# Vivado block design bd_8be5, xcvp1802-lsvc4072-2MP-e-S, Vivado 2022.2.2
# (continued, part 2 of 3)
set_property -dict [list \
  CONFIG.CONTROLLERTYPE LPDDR4_SDRAM \
  CONFIG.MC_ATTR_FILE nocattrs.dat \
  CONFIG.MC_CASLATENCY 28 \
  CONFIG.MC_CASWRITELATENCY 14 \
  CONFIG.MC_CHAN_REGION0 DDR_LOW0 \
  CONFIG.MC_CHAN_REGION1 DDR_LOW1 \
  CONFIG.MC_COMPONENT_WIDTH x32 \
  CONFIG.MC_DATAWIDTH 32 \
  CONFIG.MC_DC_CMD_CREDITS 0x000002a8 \
  CONFIG.MC_DM_WIDTH 4 \
  CONFIG.MC_DQS_WIDTH 4 \
  CONFIG.MC_DQ_WIDTH 32 \
  CONFIG.MC_EN_INTR_RESP TRUE \
  CONFIG.MC_EXMON_CLR_EXE 0x00000100 \
  CONFIG.MC_FLIPPED_PINOUT true \
  CONFIG.MC_FREQ_SEL MEMORY_CLK_FROM_SYS_CLK \
  CONFIG.MC_INTERLEAVE_SIZE 128 \
  CONFIG.MC_IP_TIMEPERIOD0_FOR_OP 5000 \
  CONFIG.MC_MEMORY_SPEEDGRADE LPDDR4-4267 \
  CONFIG.MC_MEM_INIT_FILE no_file_loaded \
  CONFIG.MC_NO_CHANNELS Dual \
  CONFIG.MC_ODTLon 6 \
  CONFIG.MC_OP_TIMEPERIOD0 625 \
  CONFIG.MC_OP_TIMEPERIOD1 513 \
  CONFIG.MC_PHYS_NAME DDRMC_X0Y0 \
  CONFIG.MC_REG_ADEC0 0x00000000 \
  CONFIG.MC_REG_ADEC1 0x00000000 \
  CONFIG.MC_REG_ADEC2 0x00100080 \
  CONFIG.MC_REG_ADEC3 0x00000078 \
  CONFIG.MC_REG_ADEC4 0x30c30c30 \
  CONFIG.MC_REG_ADEC5 0x1349140f \
  CONFIG.MC_REG_ADEC6 0x185d6554 \
  CONFIG.MC_REG_ADEC7 0x1d71b699 \
  CONFIG.MC_REG_ADEC8 0x02c30c1e \
  CONFIG.MC_REG_ADEC9 0x07185103 \
  CONFIG.MC_REG_ADEC10 0x0c2ca248 \
  CONFIG.MC_REG_ADEC11 0x007f038d \
  CONFIG.MC_REG_CMDQ_BER_RATE_CTRL 0x003ffc0f \
  CONFIG.MC_REG_CMDQ_BEW_RATE_CTRL 0x003ffc0f \
  CONFIG.MC_REG_CMDQ_CTRL0 0x01084210 \
  CONFIG.MC_REG_CMDQ_CTRL1 0x01084210 \
  CONFIG.MC_REG_CMDQ_ISR_RATE_CTRL 0x003ffc0f \
  CONFIG.MC_REG_CMDQ_ISW_RATE_CTRL 0x003ffc0f \
  CONFIG.MC_REG_CMDQ_LLR_RATE_CTRL 0x003ffc0f \
  CONFIG.MC_REG_NSU0_PORT 0x00000240 \
  CONFIG.MC_REG_NSU1_PORT 0x00000280 \
  CONFIG.MC_REG_NSU2_PORT 0x000002c0 \
  CONFIG.MC_REG_NSU3_PORT 0x00000300 \
  CONFIG.MC_REG_P0_BER_RATE_CTRL 0x003ffc0f \
  CONFIG.MC_REG_P0_BEW_RATE_CTRL 0x003ffc0f \
  CONFIG.MC_REG_P0_ISR_RATE_CTRL 0x003ffc0f \
  CONFIG.MC_REG_P0_ISW_RATE_CTRL 0x003ffc0f \
  CONFIG.MC_REG_P0_LLR_RATE_CTRL 0x003ffc0f \
  CONFIG.MC_REG_P1_BER_RATE_CTRL 0x003ffc0f \
  CONFIG.MC_REG_P1_BEW_RATE_CTRL 0x003ffc0f \
  CONFIG.MC_REG_P1_ISR_RATE_CTRL 0x003ffc0f \
  CONFIG.MC_REG_P1_ISW_RATE_CTRL 0x003ffc0f \
  CONFIG.MC_REG_P1_LLR_RATE_CTRL 0x003ffc0f \
  CONFIG.MC_REG_P2_BER_RATE_CTRL 0x003ffc0f \
  CONFIG.MC_REG_P2_BEW_RATE_CTRL 0x003ffc0f \
  CONFIG.MC_REG_P2_ISR_RATE_CTRL 0x003ffc0f \
  CONFIG.MC_REG_P2_ISW_RATE_CTRL 0x003ffc0f \
  CONFIG.MC_REG_P2_LLR_RATE_CTRL 0x003ffc0f \
  CONFIG.MC_REG_P3_BER_RATE_CTRL 0x003ffc0f \
  CONFIG.MC_REG_P3_BEW_RATE_CTRL 0x003ffc0f \
  CONFIG.MC_REG_P3_ISR_RATE_CTRL 0x003ffc0f \
  CONFIG.MC_REG_P3_ISW_RATE_CTRL 0x003ffc0f \
  CONFIG.MC_REG_P3_LLR_RATE_CTRL 0x003ffc0f \
  CONFIG.MC_REG_QOS0 0x001e01e0 \
  CONFIG.MC_REG_QOS1 0x0ff00804 \
  CONFIG.MC_REG_QOS2 0x0003fc02 \
  CONFIG.MC_REG_QOS_RATE_CTRL_SCALE 0x00000000 \
  CONFIG.MC_REG_QOS_TIMEOUT0 0x01084210 \
  CONFIG.MC_REG_QOS_TIMEOUT1 0xffffffff \
  CONFIG.MC_REG_QOS_TIMEOUT2 0x000000ff \
  CONFIG.MC_REG_RATE_CTRL_SCALE 0x00000000 \
  CONFIG.MC_REG_RD_DRR_TKN_P0 0x00ff0404 \
  CONFIG.MC_REG_RD_DRR_TKN_P1 0x00ff0404 \
  CONFIG.MC_REG_RD_DRR_TKN_P2 0x00ff0404 \
  CONFIG.MC_REG_RD_DRR_TKN_P3 0x00ff0404 \
  CONFIG.MC_REG_WR_DRR_TKN_P0 0x0000ff04 \
  CONFIG.MC_REG_WR_DRR_TKN_P1 0x0000ff04 \
  CONFIG.MC_REG_WR_DRR_TKN_P2 0x0000ff04 \
  CONFIG.MC_REG_WR_DRR_TKN_P3 0x0000ff04 \
  CONFIG.MC_STACKHEIGHT 1 \
  CONFIG.MC_SYSTEM_CLOCK Differential \
  CONFIG.MC_TCKE 12 \
  CONFIG.MC_TCKEMIN 12 \
  CONFIG.MC_TMRD_nCK 23 \
  CONFIG.MC_TMRW_nCK 16 \
  CONFIG.MC_TOSCO_nCK 64 \
  CONFIG.MC_TRAS_nCK 68 \
  CONFIG.MC_TRCD_nCK 29 \
  CONFIG.MC_TRPAB_nCK 34 \
  CONFIG.MC_TRPPB_nCK 29 \
  CONFIG.MC_TRRD_nCK 12 \
  CONFIG.MC_TWR_nCK 29 \
  CONFIG.MC_TWTR_nCK 16 \
  CONFIG.MC_TXP 12 \
  CONFIG.MC_TXPMIN 12 \
  CONFIG.MC_TZQCAL_div4 400 \
  CONFIG.MC_TZQLAT_div4 12 \
  CONFIG.MC_TZQLAT_nCK 48 \
  CONFIG.MC_UB_CLK_MUX 0x00000000 \
  CONFIG.MC_XMPU_CONFIG0 0x00000008 \
  CONFIG.MC_XMPU_CONFIG1 0x00000008 \
  CONFIG.MC_XMPU_CONFIG2 0x00000008 \
  CONFIG.MC_XMPU_CONFIG3 0x00000008 \
  CONFIG.MC_XMPU_CONFIG4 0x00000008 \
  CONFIG.MC_XMPU_CONFIG5 0x00000008 \
  CONFIG.MC_XMPU_CONFIG6 0x00000008 \
  CONFIG.MC_XMPU_CONFIG7 0x00000008 \
  CONFIG.MC_XMPU_CONFIG8 0x00000008 \
  CONFIG.MC_XMPU_CONFIG9 0x00000008 \
  CONFIG.MC_XMPU_CONFIG10 0x00000008 \
  CONFIG.MC_XMPU_CONFIG11 0x00000008 \
  CONFIG.MC_XMPU_CONFIG12 0x00000008 \
  CONFIG.MC_XMPU_CONFIG13 0x00000008 \
  CONFIG.MC_XMPU_CONFIG14 0x00000008 \
  CONFIG.MC_XMPU_CONFIG15 0x00000008 \
  CONFIG.MC_XMPU_CTRL 0x0000000b \
  CONFIG.MC_XMPU_END_HI0 0x00000000 \
  CONFIG.MC_XMPU_END_HI1 0x00000000 \
  CONFIG.MC_XMPU_END_HI2 0x00000000 \
  CONFIG.MC_XMPU_END_HI3 0x00000000 \
  CONFIG.MC_XMPU_END_HI4 0x00000000 \
  CONFIG.MC_XMPU_END_HI5 0x00000000 \
  CONFIG.MC_XMPU_END_HI6 0x00000000 \
  CONFIG.MC_XMPU_END_HI7 0x00000000 \
  CONFIG.MC_XMPU_END_HI8 0x00000000 \
  CONFIG.MC_XMPU_END_HI9 0x00000000 \
  CONFIG.MC_XMPU_END_HI10 0x00000000 \
  CONFIG.MC_XMPU_END_HI11 0x00000000 \
  CONFIG.MC_XMPU_END_HI12 0x00000000 \
  CONFIG.MC_XMPU_END_HI13 0x00000000 \
  CONFIG.MC_XMPU_END_HI14 0x00000000 \
  CONFIG.MC_XMPU_END_HI15 0x00000000 \
  CONFIG.MC_XMPU_END_LO0 0x00000000 \
  CONFIG.MC_XMPU_END_LO1 0x00000000 \
  CONFIG.MC_XMPU_END_LO2 0x00000000 \
  CONFIG.MC_XMPU_END_LO3 0x00000000 \
  CONFIG.MC_XMPU_END_LO4 0x00000000 \
  CONFIG.MC_XMPU_END_LO5 0x00000000 \
  CONFIG.MC_XMPU_END_LO6 0x00000000 \
  CONFIG.MC_XMPU_END_LO7 0x00000000 \
  CONFIG.MC_XMPU_END_LO8 0x00000000 \
  CONFIG.MC_XMPU_END_LO9 0x00000000 \
  CONFIG.MC_XMPU_END_LO10 0x00000000 \
  CONFIG.MC_XMPU_END_LO11 0x00000000 \
  CONFIG.MC_XMPU_END_LO12 0x00000000 \
  CONFIG.MC_XMPU_END_LO13 0x00000000 \
  CONFIG.MC_XMPU_END_LO14 0x00000000 \
  CONFIG.MC_XMPU_END_LO15 0x00000000 \
  CONFIG.MC_XMPU_MASTER0 0x00000000 \
  CONFIG.MC_XMPU_MASTER1 0x00000000 \
  CONFIG.MC_XMPU_MASTER2 0x00000000 \
  CONFIG.MC_XMPU_MASTER3 0x00000000 \
  CONFIG.MC_XMPU_MASTER4 0x00000000 \
  CONFIG.MC_XMPU_MASTER5 0x00000000 \
  CONFIG.MC_XMPU_MASTER6 0x00000000 \
  CONFIG.MC_XMPU_MASTER7 0x00000000 \
  CONFIG.MC_XMPU_MASTER8 0x00000000 \
  CONFIG.MC_XMPU_MASTER9 0x00000000 \
  CONFIG.MC_XMPU_MASTER10 0x00000000 \
  CONFIG.MC_XMPU_MASTER11 0x00000000 \
  CONFIG.MC_XMPU_MASTER12 0x00000000 \
  CONFIG.MC_XMPU_MASTER13 0x00000000 \
  CONFIG.MC_XMPU_MASTER14 0x00000000 \
  CONFIG.MC_XMPU_MASTER15 0x00000000 \
  CONFIG.MC_XMPU_START_HI0 0x00000000 \
  CONFIG.MC_XMPU_START_HI1 0x00000000 \
  CONFIG.MC_XMPU_START_HI2 0x00000000 \
  CONFIG.MC_XMPU_START_HI3 0x00000000 \
  CONFIG.MC_XMPU_START_HI4 0x00000000 \
  CONFIG.MC_XMPU_START_HI5 0x00000000 \
  CONFIG.MC_XMPU_START_HI6 0x00000000 \
  CONFIG.MC_XMPU_START_HI7 0x00000000 \
  CONFIG.MC_XMPU_START_HI8 0x00000000 \
  CONFIG.MC_XMPU_START_HI9 0x00000000 \
  CONFIG.MC_XMPU_START_HI10 0x00000000 \
  CONFIG.MC_XMPU_START_HI11 0x00000000 \
  CONFIG.MC_XMPU_START_HI12 0x00000000 \
  CONFIG.MC_XMPU_START_HI13 0x00000000 \
  CONFIG.MC_XMPU_START_HI14 0x00000000 \
  CONFIG.MC_XMPU_START_HI15 0x00000000 \
  CONFIG.MC_XMPU_START_LO0 0x00000000 \
  CONFIG.MC_XMPU_START_LO1 0x00000000 \
  CONFIG.MC_XMPU_START_LO2 0x00000000 \
  CONFIG.MC_XMPU_START_LO3 0x00000000 \
  CONFIG.MC_XMPU_START_LO4 0x00000000 \
  CONFIG.MC_XMPU_START_LO5 0x00000000 \
  CONFIG.MC_XMPU_START_LO6 0x00000000 \
  CONFIG.MC_XMPU_START_LO7 0x00000000 \
  CONFIG.MC_XMPU_START_LO8 0x00000000 \
  CONFIG.MC_XMPU_START_LO9 0x00000000 \
  CONFIG.MC_XMPU_START_LO10 0x00000000 \
  CONFIG.MC_XMPU_START_LO11 0x00000000 \
  CONFIG.MC_XMPU_START_LO12 0x00000000 \
  CONFIG.MC_XMPU_START_LO13 0x00000000 \
  CONFIG.MC_XMPU_START_LO14 0x00000000 \
  CONFIG.MC_XMPU_START_LO15 0x00000000 \
  CONFIG.MC_XPLL_CLKOUT1_PERIOD 1250 \
  CONFIG.NOC_FREQ 960 \
  CONFIG.NUM_MC 1 \
  CONFIG.USER_NPI_REG_MC_NSU_0_EGR 0x00473610 \
  CONFIG.USER_NPI_REG_MC_NSU_0_ING 0x04534101 \
  CONFIG.USER_NPI_REG_MC_NSU_1_EGR 0x00473610 \
  CONFIG.USER_NPI_REG_MC_NSU_1_ING 0x04534101 \
  CONFIG.USER_NPI_REG_MC_NSU_2_EGR 0x00473610 \
  CONFIG.USER_NPI_REG_MC_NSU_2_ING 0x04534101 \
  CONFIG.USER_NPI_REG_MC_NSU_3_EGR 0x00473610 \
  CONFIG.USER_NPI_REG_MC_NSU_3_ING 0x04534101 \
] [get_bd_cells MC0_ddrc]
create_bd_cell -type hier hier_nsw

# ---- hierarchy /hier_nsw ----
current_bd_instance /hier_nsw
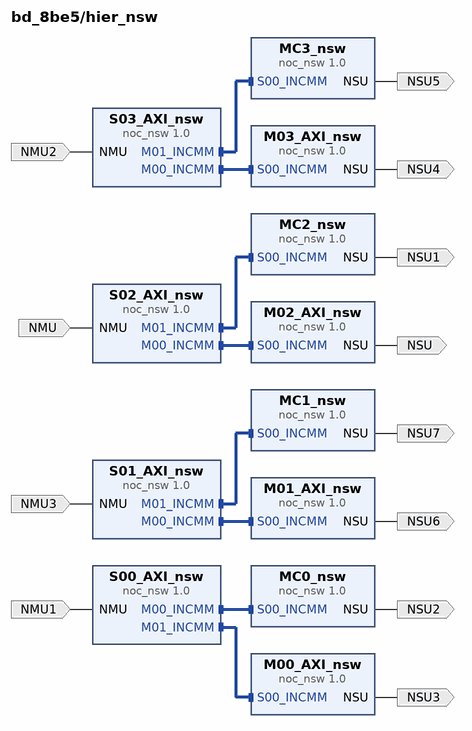
[diagram p1: block diagram inside /hier_nsw]
create_bd_pin -dir I NMU
create_bd_pin -dir O NSU
create_bd_pin -dir O NSU1
create_bd_pin -dir I NMU1
create_bd_pin -dir O NSU2
create_bd_pin -dir O NSU3
create_bd_pin -dir I NMU2
create_bd_pin -dir O NSU4
create_bd_pin -dir O NSU5
create_bd_pin -dir I NMU3
create_bd_pin -dir O NSU6
create_bd_pin -dir O NSU7

create_bd_cell -type ip -vlnv xilinx.com:ip:noc_nsw:1.0 S02_AXI_nsw
set_property -dict [list \
  CONFIG.NSW_MODE SW_Master \
  CONFIG.NSW_NUM_PATHS 2 \
  CONFIG.NSW_PATH_TYPE RDWR:RDWR \
  CONFIG.NSW_PROTOCOL MemoryMapped \
] [get_bd_cells S02_AXI_nsw]
create_bd_cell -type ip -vlnv xilinx.com:ip:noc_nsw:1.0 M02_AXI_nsw
set_property -dict [list \
  CONFIG.NSW_MODE SW_Slave \
  CONFIG.NSW_NUM_PATHS 1 \
  CONFIG.NSW_PATH_TYPE RDWR \
  CONFIG.NSW_PROTOCOL MemoryMapped \
] [get_bd_cells M02_AXI_nsw]
create_bd_cell -type ip -vlnv xilinx.com:ip:noc_nsw:1.0 MC2_nsw
set_property -dict [list \
  CONFIG.NSW_MODE SW_Slave \
  CONFIG.NSW_NUM_PATHS 1 \
  CONFIG.NSW_PATH_TYPE RDWR \
  CONFIG.NSW_PROTOCOL MemoryMapped \
] [get_bd_cells MC2_nsw]
create_bd_cell -type ip -vlnv xilinx.com:ip:noc_nsw:1.0 S00_AXI_nsw
set_property -dict [list \
  CONFIG.NSW_MODE SW_Master \
  CONFIG.NSW_NUM_PATHS 2 \
  CONFIG.NSW_PATH_TYPE RDWR:RDWR \
  CONFIG.NSW_PROTOCOL MemoryMapped \
] [get_bd_cells S00_AXI_nsw]
create_bd_cell -type ip -vlnv xilinx.com:ip:noc_nsw:1.0 MC0_nsw
set_property -dict [list \
  CONFIG.NSW_MODE SW_Slave \
  CONFIG.NSW_NUM_PATHS 1 \
  CONFIG.NSW_PATH_TYPE RDWR \
  CONFIG.NSW_PROTOCOL MemoryMapped \
] [get_bd_cells MC0_nsw]
create_bd_cell -type ip -vlnv xilinx.com:ip:noc_nsw:1.0 M00_AXI_nsw
set_property -dict [list \
  CONFIG.NSW_MODE SW_Slave \
  CONFIG.NSW_NUM_PATHS 1 \
  CONFIG.NSW_PATH_TYPE RDWR \
  CONFIG.NSW_PROTOCOL MemoryMapped \
] [get_bd_cells M00_AXI_nsw]
create_bd_cell -type ip -vlnv xilinx.com:ip:noc_nsw:1.0 S03_AXI_nsw
set_property -dict [list \
  CONFIG.NSW_MODE SW_Master \
  CONFIG.NSW_NUM_PATHS 2 \
  CONFIG.NSW_PATH_TYPE RDWR:RDWR \
  CONFIG.NSW_PROTOCOL MemoryMapped \
] [get_bd_cells S03_AXI_nsw]
create_bd_cell -type ip -vlnv xilinx.com:ip:noc_nsw:1.0 M03_AXI_nsw
set_property -dict [list \
  CONFIG.NSW_MODE SW_Slave \
  CONFIG.NSW_NUM_PATHS 1 \
  CONFIG.NSW_PATH_TYPE RDWR \
  CONFIG.NSW_PROTOCOL MemoryMapped \
] [get_bd_cells M03_AXI_nsw]
create_bd_cell -type ip -vlnv xilinx.com:ip:noc_nsw:1.0 MC3_nsw
set_property -dict [list \
  CONFIG.NSW_MODE SW_Slave \
  CONFIG.NSW_NUM_PATHS 1 \
  CONFIG.NSW_PATH_TYPE RDWR \
  CONFIG.NSW_PROTOCOL MemoryMapped \
] [get_bd_cells MC3_nsw]
create_bd_cell -type ip -vlnv xilinx.com:ip:noc_nsw:1.0 S01_AXI_nsw
set_property -dict [list \
  CONFIG.NSW_MODE SW_Master \
  CONFIG.NSW_NUM_PATHS 2 \
  CONFIG.NSW_PATH_TYPE RDWR:RDWR \
  CONFIG.NSW_PROTOCOL MemoryMapped \
] [get_bd_cells S01_AXI_nsw]
create_bd_cell -type ip -vlnv xilinx.com:ip:noc_nsw:1.0 M01_AXI_nsw
set_property -dict [list \
  CONFIG.NSW_MODE SW_Slave \
  CONFIG.NSW_NUM_PATHS 1 \
  CONFIG.NSW_PATH_TYPE RDWR \
  CONFIG.NSW_PROTOCOL MemoryMapped \
] [get_bd_cells M01_AXI_nsw]
create_bd_cell -type ip -vlnv xilinx.com:ip:noc_nsw:1.0 MC1_nsw
set_property -dict [list \
  CONFIG.NSW_MODE SW_Slave \
  CONFIG.NSW_NUM_PATHS 1 \
  CONFIG.NSW_PATH_TYPE RDWR \
  CONFIG.NSW_PROTOCOL MemoryMapped \
] [get_bd_cells MC1_nsw]

# ---- connections ----

current_bd_instance /hier_nsw
connect_bd_intf_net -intf_net S00_AXI_nsw_M00_INCMM [get_bd_intf_pins S00_AXI_nsw/M00_INCMM] [get_bd_intf_pins MC0_nsw/S00_INCMM]
connect_bd_intf_net -intf_net S00_AXI_nsw_M01_INCMM [get_bd_intf_pins S00_AXI_nsw/M01_INCMM] [get_bd_intf_pins M00_AXI_nsw/S00_INCMM]
connect_bd_intf_net -intf_net S01_AXI_nsw_M00_INCMM [get_bd_intf_pins S01_AXI_nsw/M00_INCMM] [get_bd_intf_pins M01_AXI_nsw/S00_INCMM]
connect_bd_intf_net -intf_net S01_AXI_nsw_M01_INCMM [get_bd_intf_pins S01_AXI_nsw/M01_INCMM] [get_bd_intf_pins MC1_nsw/S00_INCMM]
connect_bd_intf_net -intf_net S02_AXI_nsw_M00_INCMM [get_bd_intf_pins S02_AXI_nsw/M00_INCMM] [get_bd_intf_pins M02_AXI_nsw/S00_INCMM]
connect_bd_intf_net -intf_net S02_AXI_nsw_M01_INCMM [get_bd_intf_pins S02_AXI_nsw/M01_INCMM] [get_bd_intf_pins MC2_nsw/S00_INCMM]
connect_bd_intf_net -intf_net S03_AXI_nsw_M00_INCMM [get_bd_intf_pins S03_AXI_nsw/M00_INCMM] [get_bd_intf_pins M03_AXI_nsw/S00_INCMM]
connect_bd_intf_net -intf_net S03_AXI_nsw_M01_INCMM [get_bd_intf_pins S03_AXI_nsw/M01_INCMM] [get_bd_intf_pins MC3_nsw/S00_INCMM]
connect_bd_net -net M00_AXI_nsw_NSU [get_bd_pins M00_AXI_nsw/NSU] [get_bd_pins NSU3]
connect_bd_net -net M01_AXI_nsw_NSU [get_bd_pins M01_AXI_nsw/NSU] [get_bd_pins NSU6]
connect_bd_net -net M02_AXI_nsw_NSU [get_bd_pins M02_AXI_nsw/NSU] [get_bd_pins NSU]
connect_bd_net -net M03_AXI_nsw_NSU [get_bd_pins M03_AXI_nsw/NSU] [get_bd_pins NSU4]
connect_bd_net -net MC0_nsw_NSU [get_bd_pins MC0_nsw/NSU] [get_bd_pins NSU2]
connect_bd_net -net MC1_nsw_NSU [get_bd_pins MC1_nsw/NSU] [get_bd_pins NSU7]
connect_bd_net -net MC2_nsw_NSU [get_bd_pins MC2_nsw/NSU] [get_bd_pins NSU1]
connect_bd_net -net MC3_nsw_NSU [get_bd_pins MC3_nsw/NSU] [get_bd_pins NSU5]
connect_bd_net -net S00_AXI_nmu_NMU [get_bd_pins NMU1] [get_bd_pins S00_AXI_nsw/NMU]
connect_bd_net -net S01_AXI_nmu_NMU [get_bd_pins NMU3] [get_bd_pins S01_AXI_nsw/NMU]
connect_bd_net -net S02_AXI_nmu_NMU [get_bd_pins NMU] [get_bd_pins S02_AXI_nsw/NMU]
connect_bd_net -net S03_AXI_nmu_NMU [get_bd_pins NMU2] [get_bd_pins S03_AXI_nsw/NMU]
set_property HDL_ATTRIBUTE.DONT_TOUCH true [get_bd_cells S02_AXI_nsw]
set_property HDL_ATTRIBUTE.NOC.IS_NOC_CELL true [get_bd_cells S02_AXI_nsw]
set_property HDL_ATTRIBUTE.SYNTH_ONLY true [get_bd_cells S02_AXI_nsw]
set_property HDL_ATTRIBUTE.DONT_TOUCH true [get_bd_cells M02_AXI_nsw]
set_property HDL_ATTRIBUTE.NOC.IS_NOC_CELL true [get_bd_cells M02_AXI_nsw]
set_property HDL_ATTRIBUTE.SYNTH_ONLY true [get_bd_cells M02_AXI_nsw]
set_property HDL_ATTRIBUTE.DONT_TOUCH true [get_bd_cells MC2_nsw]
set_property HDL_ATTRIBUTE.NOC.IS_NOC_CELL true [get_bd_cells MC2_nsw]
set_property HDL_ATTRIBUTE.SYNTH_ONLY true [get_bd_cells MC2_nsw]
set_property HDL_ATTRIBUTE.DONT_TOUCH true [get_bd_cells S00_AXI_nsw]
set_property HDL_ATTRIBUTE.NOC.IS_NOC_CELL true [get_bd_cells S00_AXI_nsw]
set_property HDL_ATTRIBUTE.SYNTH_ONLY true [get_bd_cells S00_AXI_nsw]
set_property HDL_ATTRIBUTE.DONT_TOUCH true [get_bd_cells MC0_nsw]
set_property HDL_ATTRIBUTE.NOC.IS_NOC_CELL true [get_bd_cells MC0_nsw]
set_property HDL_ATTRIBUTE.SYNTH_ONLY true [get_bd_cells MC0_nsw]
set_property HDL_ATTRIBUTE.DONT_TOUCH true [get_bd_cells M00_AXI_nsw]
set_property HDL_ATTRIBUTE.NOC.IS_NOC_CELL true [get_bd_cells M00_AXI_nsw]
set_property HDL_ATTRIBUTE.SYNTH_ONLY true [get_bd_cells M00_AXI_nsw]
set_property HDL_ATTRIBUTE.DONT_TOUCH true [get_bd_cells S03_AXI_nsw]
set_property HDL_ATTRIBUTE.NOC.IS_NOC_CELL true [get_bd_cells S03_AXI_nsw]
set_property HDL_ATTRIBUTE.SYNTH_ONLY true [get_bd_cells S03_AXI_nsw]
set_property HDL_ATTRIBUTE.DONT_TOUCH true [get_bd_cells M03_AXI_nsw]
set_property HDL_ATTRIBUTE.NOC.IS_NOC_CELL true [get_bd_cells M03_AXI_nsw]
set_property HDL_ATTRIBUTE.SYNTH_ONLY true [get_bd_cells M03_AXI_nsw]
set_property HDL_ATTRIBUTE.DONT_TOUCH true [get_bd_cells MC3_nsw]
set_property HDL_ATTRIBUTE.NOC.IS_NOC_CELL true [get_bd_cells MC3_nsw]
set_property HDL_ATTRIBUTE.SYNTH_ONLY true [get_bd_cells MC3_nsw]
set_property HDL_ATTRIBUTE.DONT_TOUCH true [get_bd_cells S01_AXI_nsw]
set_property HDL_ATTRIBUTE.NOC.IS_NOC_CELL true [get_bd_cells S01_AXI_nsw]
set_property HDL_ATTRIBUTE.SYNTH_ONLY true [get_bd_cells S01_AXI_nsw]
set_property HDL_ATTRIBUTE.DONT_TOUCH true [get_bd_cells M01_AXI_nsw]
set_property HDL_ATTRIBUTE.NOC.IS_NOC_CELL true [get_bd_cells M01_AXI_nsw]
set_property HDL_ATTRIBUTE.SYNTH_ONLY true [get_bd_cells M01_AXI_nsw]
set_property HDL_ATTRIBUTE.DONT_TOUCH true [get_bd_cells MC1_nsw]
set_property HDL_ATTRIBUTE.NOC.IS_NOC_CELL true [get_bd_cells MC1_nsw]
set_property HDL_ATTRIBUTE.SYNTH_ONLY true [get_bd_cells MC1_nsw]
set_property HDL_ATTRIBUTE.DONT_TOUCH true [get_bd_intf_nets S00_AXI_nsw_M00_INCMM]
set_property HDL_ATTRIBUTE.NOC.IS_NOC_NET true [get_bd_intf_nets S00_AXI_nsw_M00_INCMM]
set_property HDL_ATTRIBUTE.SYNTH_ONLY true [get_bd_intf_nets S00_AXI_nsw_M00_INCMM]
set_property HDL_ATTRIBUTE.DONT_TOUCH true [get_bd_intf_nets S00_AXI_nsw_M01_INCMM]
set_property HDL_ATTRIBUTE.NOC.IS_NOC_NET true [get_bd_intf_nets S00_AXI_nsw_M01_INCMM]
set_property HDL_ATTRIBUTE.SYNTH_ONLY true [get_bd_intf_nets S00_AXI_nsw_M01_INCMM]
set_property HDL_ATTRIBUTE.DONT_TOUCH true [get_bd_intf_nets S01_AXI_nsw_M00_INCMM]
set_property HDL_ATTRIBUTE.NOC.IS_NOC_NET true [get_bd_intf_nets S01_AXI_nsw_M00_INCMM]
set_property HDL_ATTRIBUTE.SYNTH_ONLY true [get_bd_intf_nets S01_AXI_nsw_M00_INCMM]
set_property HDL_ATTRIBUTE.DONT_TOUCH true [get_bd_intf_nets S01_AXI_nsw_M01_INCMM]
set_property HDL_ATTRIBUTE.NOC.IS_NOC_NET true [get_bd_intf_nets S01_AXI_nsw_M01_INCMM]
set_property HDL_ATTRIBUTE.SYNTH_ONLY true [get_bd_intf_nets S01_AXI_nsw_M01_INCMM]
set_property HDL_ATTRIBUTE.DONT_TOUCH true [get_bd_intf_nets S02_AXI_nsw_M00_INCMM]
set_property HDL_ATTRIBUTE.NOC.IS_NOC_NET true [get_bd_intf_nets S02_AXI_nsw_M00_INCMM]
set_property HDL_ATTRIBUTE.SYNTH_ONLY true [get_bd_intf_nets S02_AXI_nsw_M00_INCMM]
set_property HDL_ATTRIBUTE.DONT_TOUCH true [get_bd_intf_nets S02_AXI_nsw_M01_INCMM]
set_property HDL_ATTRIBUTE.NOC.IS_NOC_NET true [get_bd_intf_nets S02_AXI_nsw_M01_INCMM]
set_property HDL_ATTRIBUTE.SYNTH_ONLY true [get_bd_intf_nets S02_AXI_nsw_M01_INCMM]
set_property HDL_ATTRIBUTE.DONT_TOUCH true [get_bd_intf_nets S03_AXI_nsw_M00_INCMM]
set_property HDL_ATTRIBUTE.NOC.IS_NOC_NET true [get_bd_intf_nets S03_AXI_nsw_M00_INCMM]
set_property HDL_ATTRIBUTE.SYNTH_ONLY true [get_bd_intf_nets S03_AXI_nsw_M00_INCMM]
set_property HDL_ATTRIBUTE.DONT_TOUCH true [get_bd_intf_nets S03_AXI_nsw_M01_INCMM]
set_property HDL_ATTRIBUTE.NOC.IS_NOC_NET true [get_bd_intf_nets S03_AXI_nsw_M01_INCMM]
set_property HDL_ATTRIBUTE.SYNTH_ONLY true [get_bd_intf_nets S03_AXI_nsw_M01_INCMM]
set_property HDL_ATTRIBUTE.DONT_TOUCH true [get_bd_nets M00_AXI_nsw_NSU]
set_property HDL_ATTRIBUTE.NOC.IS_NOC_NET true [get_bd_nets M00_AXI_nsw_NSU]
set_property HDL_ATTRIBUTE.SYNTH_ONLY true [get_bd_nets M00_AXI_nsw_NSU]
set_property HDL_ATTRIBUTE.DONT_TOUCH true [get_bd_nets M01_AXI_nsw_NSU]
set_property HDL_ATTRIBUTE.NOC.IS_NOC_NET true [get_bd_nets M01_AXI_nsw_NSU]
set_property HDL_ATTRIBUTE.SYNTH_ONLY true [get_bd_nets M01_AXI_nsw_NSU]
set_property HDL_ATTRIBUTE.DONT_TOUCH true [get_bd_nets M02_AXI_nsw_NSU]
set_property HDL_ATTRIBUTE.NOC.IS_NOC_NET true [get_bd_nets M02_AXI_nsw_NSU]
set_property HDL_ATTRIBUTE.SYNTH_ONLY true [get_bd_nets M02_AXI_nsw_NSU]
set_property HDL_ATTRIBUTE.DONT_TOUCH true [get_bd_nets M03_AXI_nsw_NSU]
set_property HDL_ATTRIBUTE.NOC.IS_NOC_NET true [get_bd_nets M03_AXI_nsw_NSU]
set_property HDL_ATTRIBUTE.SYNTH_ONLY true [get_bd_nets M03_AXI_nsw_NSU]
set_property HDL_ATTRIBUTE.DONT_TOUCH true [get_bd_nets MC0_nsw_NSU]
set_property HDL_ATTRIBUTE.NOC.IS_NOC_NET true [get_bd_nets MC0_nsw_NSU]
set_property HDL_ATTRIBUTE.SYNTH_ONLY true [get_bd_nets MC0_nsw_NSU]
set_property HDL_ATTRIBUTE.DONT_TOUCH true [get_bd_nets MC1_nsw_NSU]
set_property HDL_ATTRIBUTE.NOC.IS_NOC_NET true [get_bd_nets MC1_nsw_NSU]
set_property HDL_ATTRIBUTE.SYNTH_ONLY true [get_bd_nets MC1_nsw_NSU]
set_property HDL_ATTRIBUTE.DONT_TOUCH true [get_bd_nets MC2_nsw_NSU]
set_property HDL_ATTRIBUTE.NOC.IS_NOC_NET true [get_bd_nets MC2_nsw_NSU]
set_property HDL_ATTRIBUTE.SYNTH_ONLY true [get_bd_nets MC2_nsw_NSU]
set_property HDL_ATTRIBUTE.DONT_TOUCH true [get_bd_nets MC3_nsw_NSU]
set_property HDL_ATTRIBUTE.NOC.IS_NOC_NET true [get_bd_nets MC3_nsw_NSU]
set_property HDL_ATTRIBUTE.SYNTH_ONLY true [get_bd_nets MC3_nsw_NSU]
set_property HDL_ATTRIBUTE.DONT_TOUCH true [get_bd_nets S00_AXI_nmu_NMU]
set_property HDL_ATTRIBUTE.NOC.IS_NOC_NET true [get_bd_nets S00_AXI_nmu_NMU]
set_property HDL_ATTRIBUTE.SYNTH_ONLY true [get_bd_nets S00_AXI_nmu_NMU]
set_property HDL_ATTRIBUTE.DONT_TOUCH true [get_bd_nets S01_AXI_nmu_NMU]
set_property HDL_ATTRIBUTE.NOC.IS_NOC_NET true [get_bd_nets S01_AXI_nmu_NMU]
set_property HDL_ATTRIBUTE.SYNTH_ONLY true [get_bd_nets S01_AXI_nmu_NMU]
set_property HDL_ATTRIBUTE.DONT_TOUCH true [get_bd_nets S02_AXI_nmu_NMU]
set_property HDL_ATTRIBUTE.NOC.IS_NOC_NET true [get_bd_nets S02_AXI_nmu_NMU]
set_property HDL_ATTRIBUTE.SYNTH_ONLY true [get_bd_nets S02_AXI_nmu_NMU]
set_property HDL_ATTRIBUTE.DONT_TOUCH true [get_bd_nets S03_AXI_nmu_NMU]
set_property HDL_ATTRIBUTE.NOC.IS_NOC_NET true [get_bd_nets S03_AXI_nmu_NMU]
set_property HDL_ATTRIBUTE.SYNTH_ONLY true [get_bd_nets S03_AXI_nmu_NMU]

current_bd_instance /
connect_bd_intf_net [get_bd_intf_ports M00_AXI] [get_bd_intf_pins M00_AXI_nsu/MAXI4]
connect_bd_intf_net [get_bd_intf_ports M01_AXI] [get_bd_intf_pins M01_AXI_nsu/MAXI4]
connect_bd_intf_net [get_bd_intf_ports M02_AXI] [get_bd_intf_pins M02_AXI_nsu/MAXI4]
connect_bd_intf_net [get_bd_intf_ports M03_AXI] [get_bd_intf_pins M03_AXI_nsu/MAXI4]
connect_bd_intf_net [get_bd_intf_ports CH0_LPDDR4_0] [get_bd_intf_pins MC0_ddrc/CH0_LPDDR4]
connect_bd_intf_net [get_bd_intf_ports CH1_LPDDR4_0] [get_bd_intf_pins MC0_ddrc/CH1_LPDDR4]
connect_bd_intf_net [get_bd_intf_ports S00_AXI] [get_bd_intf_pins S00_AXI_nmu/SAXI4]
connect_bd_intf_net [get_bd_intf_ports S01_AXI] [get_bd_intf_pins S01_AXI_nmu/SAXI4]
connect_bd_intf_net [get_bd_intf_ports S02_AXI] [get_bd_intf_pins S02_AXI_nmu/SAXI4]
connect_bd_intf_net [get_bd_intf_ports S03_AXI] [get_bd_intf_pins S03_AXI_nmu/SAXI4]
connect_bd_intf_net -intf_net sys_clk0_1 [get_bd_intf_ports sys_clk0] [get_bd_intf_pins MC0_ddrc/SYS_CLK]
connect_bd_net -net M00_AXI_nsw_NSU [get_bd_pins hier_nsw/NSU3] [get_bd_pins M00_AXI_nsu/NSU]
connect_bd_net -net M01_AXI_nsw_NSU [get_bd_pins hier_nsw/NSU6] [get_bd_pins M01_AXI_nsu/NSU]
connect_bd_net -net M02_AXI_nsw_NSU [get_bd_pins hier_nsw/NSU] [get_bd_pins M02_AXI_nsu/NSU]
connect_bd_net -net M03_AXI_nsw_NSU [get_bd_pins hier_nsw/NSU4] [get_bd_pins M03_AXI_nsu/NSU]
connect_bd_net -net MC0_nsw_NSU [get_bd_pins hier_nsw/NSU2] [get_bd_pins MC0_ddrc/from_noc_0]
connect_bd_net -net MC1_nsw_NSU [get_bd_pins hier_nsw/NSU7] [get_bd_pins MC0_ddrc/from_noc_1]
connect_bd_net -net MC2_nsw_NSU [get_bd_pins hier_nsw/NSU1] [get_bd_pins MC0_ddrc/from_noc_2]
connect_bd_net -net MC3_nsw_NSU [get_bd_pins hier_nsw/NSU5] [get_bd_pins MC0_ddrc/from_noc_3]
connect_bd_net -net S00_AXI_nmu_NMU [get_bd_pins S00_AXI_nmu/NMU] [get_bd_pins hier_nsw/NMU1]
connect_bd_net -net S01_AXI_nmu_NMU [get_bd_pins S01_AXI_nmu/NMU] [get_bd_pins hier_nsw/NMU3]
connect_bd_net -net S02_AXI_nmu_NMU [get_bd_pins S02_AXI_nmu/NMU] [get_bd_pins hier_nsw/NMU]
connect_bd_net -net S03_AXI_nmu_NMU [get_bd_pins S03_AXI_nmu/NMU] [get_bd_pins hier_nsw/NMU2]
connect_bd_net -net aclk0_1 [get_bd_ports aclk0] [get_bd_pins S00_AXI_nmu/aclk]
connect_bd_net -net aclk1_1 [get_bd_ports aclk1] [get_bd_pins S01_AXI_nmu/aclk]
connect_bd_net -net aclk2_1 [get_bd_ports aclk2] [get_bd_pins S02_AXI_nmu/aclk]
connect_bd_net -net aclk3_1 [get_bd_ports aclk3] [get_bd_pins S03_AXI_nmu/aclk]
connect_bd_net -net aclk5_1 [get_bd_ports aclk5] \
  [get_bd_pins M03_AXI_nsu/aclk] [get_bd_pins M00_AXI_nsu/aclk] [get_bd_pins M02_AXI_nsu/aclk] [get_bd_pins M01_AXI_nsu/aclk]
connect_bd_net [get_bd_pins const_0/dout] \
  [get_bd_pins S02_AXI_nmu/NMU_RD_DEST_MODE] [get_bd_pins S02_AXI_nmu/NMU_WR_DEST_MODE] \
  [get_bd_pins S00_AXI_nmu/NMU_RD_DEST_MODE] [get_bd_pins S00_AXI_nmu/NMU_WR_DEST_MODE] \
  [get_bd_pins S03_AXI_nmu/NMU_RD_DEST_MODE] [get_bd_pins S03_AXI_nmu/NMU_WR_DEST_MODE] \
  [get_bd_pins S01_AXI_nmu/NMU_RD_DEST_MODE] [get_bd_pins S01_AXI_nmu/NMU_WR_DEST_MODE]
# net m00_axi_nsu_if_noc_npp_in_noc_credit_rdy has one end: M00_AXI_nsu/IF_NOC_NPP_IN_NOC_CREDIT_RDY
# net m00_axi_nsu_if_noc_npp_in_noc_credit_return has one end: M00_AXI_nsu/IF_NOC_NPP_IN_NOC_CREDIT_RETURN
# net m00_axi_nsu_if_noc_npp_in_noc_flit has one end: M00_AXI_nsu/IF_NOC_NPP_IN_NOC_FLIT
# net m00_axi_nsu_if_noc_npp_in_noc_valid has one end: M00_AXI_nsu/IF_NOC_NPP_IN_NOC_VALID
# net m00_axi_nsu_if_noc_npp_out_noc_credit_rdy has one end: M00_AXI_nsu/IF_NOC_NPP_OUT_NOC_CREDIT_RDY
# net m00_axi_nsu_if_noc_npp_out_noc_credit_return has one end: M00_AXI_nsu/IF_NOC_NPP_OUT_NOC_CREDIT_RETURN
# net m00_axi_nsu_if_noc_npp_out_noc_flit has one end: M00_AXI_nsu/IF_NOC_NPP_OUT_NOC_FLIT
# net m00_axi_nsu_if_noc_npp_out_noc_valid has one end: M00_AXI_nsu/IF_NOC_NPP_OUT_NOC_VALID
# net m01_axi_nsu_if_noc_npp_in_noc_credit_rdy has one end: M01_AXI_nsu/IF_NOC_NPP_IN_NOC_CREDIT_RDY
# net m01_axi_nsu_if_noc_npp_in_noc_credit_return has one end: M01_AXI_nsu/IF_NOC_NPP_IN_NOC_CREDIT_RETURN
# net m01_axi_nsu_if_noc_npp_in_noc_flit has one end: M01_AXI_nsu/IF_NOC_NPP_IN_NOC_FLIT
# net m01_axi_nsu_if_noc_npp_in_noc_valid has one end: M01_AXI_nsu/IF_NOC_NPP_IN_NOC_VALID
# net m01_axi_nsu_if_noc_npp_out_noc_credit_rdy has one end: M01_AXI_nsu/IF_NOC_NPP_OUT_NOC_CREDIT_RDY
# net m01_axi_nsu_if_noc_npp_out_noc_credit_return has one end: M01_AXI_nsu/IF_NOC_NPP_OUT_NOC_CREDIT_RETURN
# net m01_axi_nsu_if_noc_npp_out_noc_flit has one end: M01_AXI_nsu/IF_NOC_NPP_OUT_NOC_FLIT
# net m01_axi_nsu_if_noc_npp_out_noc_valid has one end: M01_AXI_nsu/IF_NOC_NPP_OUT_NOC_VALID
# net m02_axi_nsu_if_noc_npp_in_noc_credit_rdy has one end: M02_AXI_nsu/IF_NOC_NPP_IN_NOC_CREDIT_RDY
# net m02_axi_nsu_if_noc_npp_in_noc_credit_return has one end: M02_AXI_nsu/IF_NOC_NPP_IN_NOC_CREDIT_RETURN
# net m02_axi_nsu_if_noc_npp_in_noc_flit has one end: M02_AXI_nsu/IF_NOC_NPP_IN_NOC_FLIT
# net m02_axi_nsu_if_noc_npp_in_noc_valid has one end: M02_AXI_nsu/IF_NOC_NPP_IN_NOC_VALID
# net m02_axi_nsu_if_noc_npp_out_noc_credit_rdy has one end: M02_AXI_nsu/IF_NOC_NPP_OUT_NOC_CREDIT_RDY
# net m02_axi_nsu_if_noc_npp_out_noc_credit_return has one end: M02_AXI_nsu/IF_NOC_NPP_OUT_NOC_CREDIT_RETURN
# net m02_axi_nsu_if_noc_npp_out_noc_flit has one end: M02_AXI_nsu/IF_NOC_NPP_OUT_NOC_FLIT
# net m02_axi_nsu_if_noc_npp_out_noc_valid has one end: M02_AXI_nsu/IF_NOC_NPP_OUT_NOC_VALID
# net m03_axi_nsu_if_noc_npp_in_noc_credit_rdy has one end: M03_AXI_nsu/IF_NOC_NPP_IN_NOC_CREDIT_RDY
# net m03_axi_nsu_if_noc_npp_in_noc_credit_return has one end: M03_AXI_nsu/IF_NOC_NPP_IN_NOC_CREDIT_RETURN
# net m03_axi_nsu_if_noc_npp_in_noc_flit has one end: M03_AXI_nsu/IF_NOC_NPP_IN_NOC_FLIT
# net m03_axi_nsu_if_noc_npp_in_noc_valid has one end: M03_AXI_nsu/IF_NOC_NPP_IN_NOC_VALID
# net m03_axi_nsu_if_noc_npp_out_noc_credit_rdy has one end: M03_AXI_nsu/IF_NOC_NPP_OUT_NOC_CREDIT_RDY
# net m03_axi_nsu_if_noc_npp_out_noc_credit_return has one end: M03_AXI_nsu/IF_NOC_NPP_OUT_NOC_CREDIT_RETURN
# net m03_axi_nsu_if_noc_npp_out_noc_flit has one end: M03_AXI_nsu/IF_NOC_NPP_OUT_NOC_FLIT
# net m03_axi_nsu_if_noc_npp_out_noc_valid has one end: M03_AXI_nsu/IF_NOC_NPP_OUT_NOC_VALID
# net mc0_ddrc_dmc2noc_credit_rdy_0 has one end: MC0_ddrc/dmc2noc_credit_rdy_0
# net mc0_ddrc_dmc2noc_credit_rdy_1 has one end: MC0_ddrc/dmc2noc_credit_rdy_1
# net mc0_ddrc_dmc2noc_credit_rdy_2 has one end: MC0_ddrc/dmc2noc_credit_rdy_2
# net mc0_ddrc_dmc2noc_credit_rdy_3 has one end: MC0_ddrc/dmc2noc_credit_rdy_3
# net mc0_ddrc_dmc2noc_credit_rtn_0 has one end: MC0_ddrc/dmc2noc_credit_rtn_0
# net mc0_ddrc_dmc2noc_credit_rtn_1 has one end: MC0_ddrc/dmc2noc_credit_rtn_1
# net mc0_ddrc_dmc2noc_credit_rtn_2 has one end: MC0_ddrc/dmc2noc_credit_rtn_2
# net mc0_ddrc_dmc2noc_credit_rtn_3 has one end: MC0_ddrc/dmc2noc_credit_rtn_3
# net mc0_ddrc_dmc2noc_data_out_0 has one end: MC0_ddrc/dmc2noc_data_out_0
# net mc0_ddrc_dmc2noc_data_out_1 has one end: MC0_ddrc/dmc2noc_data_out_1
# net mc0_ddrc_dmc2noc_data_out_2 has one end: MC0_ddrc/dmc2noc_data_out_2
# net mc0_ddrc_dmc2noc_data_out_3 has one end: MC0_ddrc/dmc2noc_data_out_3
# net mc0_ddrc_dmc2noc_valid_out_0 has one end: MC0_ddrc/dmc2noc_valid_out_0
# net mc0_ddrc_dmc2noc_valid_out_1 has one end: MC0_ddrc/dmc2noc_valid_out_1
# net mc0_ddrc_dmc2noc_valid_out_2 has one end: MC0_ddrc/dmc2noc_valid_out_2
# net mc0_ddrc_dmc2noc_valid_out_3 has one end: MC0_ddrc/dmc2noc_valid_out_3
# net mc0_ddrc_noc2dmc_credit_rdy_0 has one end: MC0_ddrc/noc2dmc_credit_rdy_0
# net mc0_ddrc_noc2dmc_credit_rdy_1 has one end: MC0_ddrc/noc2dmc_credit_rdy_1
# net mc0_ddrc_noc2dmc_credit_rdy_2 has one end: MC0_ddrc/noc2dmc_credit_rdy_2
# net mc0_ddrc_noc2dmc_credit_rdy_3 has one end: MC0_ddrc/noc2dmc_credit_rdy_3
# net mc0_ddrc_noc2dmc_credit_rtn_0 has one end: MC0_ddrc/noc2dmc_credit_rtn_0
# net mc0_ddrc_noc2dmc_credit_rtn_1 has one end: MC0_ddrc/noc2dmc_credit_rtn_1
# net mc0_ddrc_noc2dmc_credit_rtn_2 has one end: MC0_ddrc/noc2dmc_credit_rtn_2
# net mc0_ddrc_noc2dmc_credit_rtn_3 has one end: MC0_ddrc/noc2dmc_credit_rtn_3
# net mc0_ddrc_noc2dmc_data_in_0 has one end: MC0_ddrc/noc2dmc_data_in_0
# net mc0_ddrc_noc2dmc_data_in_1 has one end: MC0_ddrc/noc2dmc_data_in_1
# net mc0_ddrc_noc2dmc_data_in_2 has one end: MC0_ddrc/noc2dmc_data_in_2
# net mc0_ddrc_noc2dmc_data_in_3 has one end: MC0_ddrc/noc2dmc_data_in_3
# net mc0_ddrc_noc2dmc_valid_in_0 has one end: MC0_ddrc/noc2dmc_valid_in_0
# net mc0_ddrc_noc2dmc_valid_in_1 has one end: MC0_ddrc/noc2dmc_valid_in_1
# net mc0_ddrc_noc2dmc_valid_in_2 has one end: MC0_ddrc/noc2dmc_valid_in_2
# net mc0_ddrc_noc2dmc_valid_in_3 has one end: MC0_ddrc/noc2dmc_valid_in_3
# net s00_axi_nmu_if_noc_npp_in_noc_credit_rdy has one end: S00_AXI_nmu/IF_NOC_NPP_IN_NOC_CREDIT_RDY
# net s00_axi_nmu_if_noc_npp_in_noc_credit_return has one end: S00_AXI_nmu/IF_NOC_NPP_IN_NOC_CREDIT_RETURN
# net s00_axi_nmu_if_noc_npp_in_noc_flit has one end: S00_AXI_nmu/IF_NOC_NPP_IN_NOC_FLIT
# net s00_axi_nmu_if_noc_npp_in_noc_valid has one end: S00_AXI_nmu/IF_NOC_NPP_IN_NOC_VALID
# net s00_axi_nmu_if_noc_npp_out_noc_credit_rdy has one end: S00_AXI_nmu/IF_NOC_NPP_OUT_NOC_CREDIT_RDY
# net s00_axi_nmu_if_noc_npp_out_noc_credit_return has one end: S00_AXI_nmu/IF_NOC_NPP_OUT_NOC_CREDIT_RETURN
# net s00_axi_nmu_if_noc_npp_out_noc_flit has one end: S00_AXI_nmu/IF_NOC_NPP_OUT_NOC_FLIT
# net s00_axi_nmu_if_noc_npp_out_noc_valid has one end: S00_AXI_nmu/IF_NOC_NPP_OUT_NOC_VALID
# net s01_axi_nmu_if_noc_npp_in_noc_credit_rdy has one end: S01_AXI_nmu/IF_NOC_NPP_IN_NOC_CREDIT_RDY
# net s01_axi_nmu_if_noc_npp_in_noc_credit_return has one end: S01_AXI_nmu/IF_NOC_NPP_IN_NOC_CREDIT_RETURN
# net s01_axi_nmu_if_noc_npp_in_noc_flit has one end: S01_AXI_nmu/IF_NOC_NPP_IN_NOC_FLIT
# net s01_axi_nmu_if_noc_npp_in_noc_valid has one end: S01_AXI_nmu/IF_NOC_NPP_IN_NOC_VALID
# net s01_axi_nmu_if_noc_npp_out_noc_credit_rdy has one end: S01_AXI_nmu/IF_NOC_NPP_OUT_NOC_CREDIT_RDY
# net s01_axi_nmu_if_noc_npp_out_noc_credit_return has one end: S01_AXI_nmu/IF_NOC_NPP_OUT_NOC_CREDIT_RETURN
# net s01_axi_nmu_if_noc_npp_out_noc_flit has one end: S01_AXI_nmu/IF_NOC_NPP_OUT_NOC_FLIT
# net s01_axi_nmu_if_noc_npp_out_noc_valid has one end: S01_AXI_nmu/IF_NOC_NPP_OUT_NOC_VALID
# net s02_axi_nmu_if_noc_npp_in_noc_credit_rdy has one end: S02_AXI_nmu/IF_NOC_NPP_IN_NOC_CREDIT_RDY
# net s02_axi_nmu_if_noc_npp_in_noc_credit_return has one end: S02_AXI_nmu/IF_NOC_NPP_IN_NOC_CREDIT_RETURN
# net s02_axi_nmu_if_noc_npp_in_noc_flit has one end: S02_AXI_nmu/IF_NOC_NPP_IN_NOC_FLIT
# net s02_axi_nmu_if_noc_npp_in_noc_valid has one end: S02_AXI_nmu/IF_NOC_NPP_IN_NOC_VALID
# net s02_axi_nmu_if_noc_npp_out_noc_credit_rdy has one end: S02_AXI_nmu/IF_NOC_NPP_OUT_NOC_CREDIT_RDY
# net s02_axi_nmu_if_noc_npp_out_noc_credit_return has one end: S02_AXI_nmu/IF_NOC_NPP_OUT_NOC_CREDIT_RETURN
# net s02_axi_nmu_if_noc_npp_out_noc_flit has one end: S02_AXI_nmu/IF_NOC_NPP_OUT_NOC_FLIT
# net s02_axi_nmu_if_noc_npp_out_noc_valid has one end: S02_AXI_nmu/IF_NOC_NPP_OUT_NOC_VALID
# net s03_axi_nmu_if_noc_npp_in_noc_credit_rdy has one end: S03_AXI_nmu/IF_NOC_NPP_IN_NOC_CREDIT_RDY
# net s03_axi_nmu_if_noc_npp_in_noc_credit_return has one end: S03_AXI_nmu/IF_NOC_NPP_IN_NOC_CREDIT_RETURN
# net s03_axi_nmu_if_noc_npp_in_noc_flit has one end: S03_AXI_nmu/IF_NOC_NPP_IN_NOC_FLIT
# net s03_axi_nmu_if_noc_npp_in_noc_valid has one end: S03_AXI_nmu/IF_NOC_NPP_IN_NOC_VALID
# net s03_axi_nmu_if_noc_npp_out_noc_credit_rdy has one end: S03_AXI_nmu/IF_NOC_NPP_OUT_NOC_CREDIT_RDY
# net s03_axi_nmu_if_noc_npp_out_noc_credit_return has one end: S03_AXI_nmu/IF_NOC_NPP_OUT_NOC_CREDIT_RETURN
# net s03_axi_nmu_if_noc_npp_out_noc_flit has one end: S03_AXI_nmu/IF_NOC_NPP_OUT_NOC_FLIT
# net s03_axi_nmu_if_noc_npp_out_noc_valid has one end: S03_AXI_nmu/IF_NOC_NPP_OUT_NOC_VALID
set_property HDL_ATTRIBUTE.DONT_TOUCH true [get_bd_cells S02_AXI_nmu]
set_property HDL_ATTRIBUTE.DONT_TOUCH true [get_bd_cells const_0]
set_property HDL_ATTRIBUTE.DONT_TOUCH true [get_bd_cells S00_AXI_nmu]
set_property HDL_ATTRIBUTE.DONT_TOUCH true [get_bd_cells S03_AXI_nmu]
set_property HDL_ATTRIBUTE.DONT_TOUCH true [get_bd_cells S01_AXI_nmu]
set_property HDL_ATTRIBUTE.DONT_TOUCH true [get_bd_cells M03_AXI_nsu]
set_property HDL_ATTRIBUTE.DONT_TOUCH true [get_bd_cells M00_AXI_nsu]
set_property HDL_ATTRIBUTE.DONT_TOUCH true [get_bd_cells M02_AXI_nsu]
set_property HDL_ATTRIBUTE.DONT_TOUCH true [get_bd_cells M01_AXI_nsu]
set_property HDL_ATTRIBUTE.DONT_TOUCH true [get_bd_cells MC0_ddrc]
set_property HDL_ATTRIBUTE.DONT_TOUCH true [get_bd_cells hier_nsw]
set_property HDL_ATTRIBUTE.NOC.IS_HIER_NSW true [get_bd_cells hier_nsw]
set_property HDL_ATTRIBUTE.NOC.IS_NOC_CELL true [get_bd_cells hier_nsw]
set_property HDL_ATTRIBUTE.SYNTH_ONLY true [get_bd_cells hier_nsw]
set_property HDL_ATTRIBUTE.DONT_TOUCH true [get_bd_nets M00_AXI_nsw_NSU]
set_property HDL_ATTRIBUTE.NOC.IS_NOC_NET true [get_bd_nets M00_AXI_nsw_NSU]
set_property HDL_ATTRIBUTE.SYNTH_ONLY true [get_bd_nets M00_AXI_nsw_NSU]
set_property HDL_ATTRIBUTE.DONT_TOUCH true [get_bd_nets M01_AXI_nsw_NSU]
set_property HDL_ATTRIBUTE.NOC.IS_NOC_NET true [get_bd_nets M01_AXI_nsw_NSU]
set_property HDL_ATTRIBUTE.SYNTH_ONLY true [get_bd_nets M01_AXI_nsw_NSU]
set_property HDL_ATTRIBUTE.DONT_TOUCH true [get_bd_nets M02_AXI_nsw_NSU]
set_property HDL_ATTRIBUTE.NOC.IS_NOC_NET true [get_bd_nets M02_AXI_nsw_NSU]
set_property HDL_ATTRIBUTE.SYNTH_ONLY true [get_bd_nets M02_AXI_nsw_NSU]
set_property HDL_ATTRIBUTE.DONT_TOUCH true [get_bd_nets M03_AXI_nsw_NSU]
set_property HDL_ATTRIBUTE.NOC.IS_NOC_NET true [get_bd_nets M03_AXI_nsw_NSU]
set_property HDL_ATTRIBUTE.SYNTH_ONLY true [get_bd_nets M03_AXI_nsw_NSU]
set_property HDL_ATTRIBUTE.DONT_TOUCH true [get_bd_nets MC0_nsw_NSU]
set_property HDL_ATTRIBUTE.NOC.IS_NOC_NET true [get_bd_nets MC0_nsw_NSU]
set_property HDL_ATTRIBUTE.SYNTH_ONLY true [get_bd_nets MC0_nsw_NSU]
set_property HDL_ATTRIBUTE.DONT_TOUCH true [get_bd_nets MC1_nsw_NSU]
set_property HDL_ATTRIBUTE.NOC.IS_NOC_NET true [get_bd_nets MC1_nsw_NSU]
set_property HDL_ATTRIBUTE.SYNTH_ONLY true [get_bd_nets MC1_nsw_NSU]
set_property HDL_ATTRIBUTE.DONT_TOUCH true [get_bd_nets MC2_nsw_NSU]
set_property HDL_ATTRIBUTE.NOC.IS_NOC_NET true [get_bd_nets MC2_nsw_NSU]
set_property HDL_ATTRIBUTE.SYNTH_ONLY true [get_bd_nets MC2_nsw_NSU]
set_property HDL_ATTRIBUTE.DONT_TOUCH true [get_bd_nets MC3_nsw_NSU]
set_property HDL_ATTRIBUTE.NOC.IS_NOC_NET true [get_bd_nets MC3_nsw_NSU]
set_property HDL_ATTRIBUTE.SYNTH_ONLY true [get_bd_nets MC3_nsw_NSU]
set_property HDL_ATTRIBUTE.DONT_TOUCH true [get_bd_nets S00_AXI_nmu_NMU]
set_property HDL_ATTRIBUTE.NOC.IS_NOC_NET true [get_bd_nets S00_AXI_nmu_NMU]
set_property HDL_ATTRIBUTE.SYNTH_ONLY true [get_bd_nets S00_AXI_nmu_NMU]
set_property HDL_ATTRIBUTE.DONT_TOUCH true [get_bd_nets S01_AXI_nmu_NMU]
set_property HDL_ATTRIBUTE.NOC.IS_NOC_NET true [get_bd_nets S01_AXI_nmu_NMU]
set_property HDL_ATTRIBUTE.SYNTH_ONLY true [get_bd_nets S01_AXI_nmu_NMU]
set_property HDL_ATTRIBUTE.DONT_TOUCH true [get_bd_nets S02_AXI_nmu_NMU]
set_property HDL_ATTRIBUTE.NOC.IS_NOC_NET true [get_bd_nets S02_AXI_nmu_NMU]
set_property HDL_ATTRIBUTE.SYNTH_ONLY true [get_bd_nets S02_AXI_nmu_NMU]
set_property HDL_ATTRIBUTE.DONT_TOUCH true [get_bd_nets S03_AXI_nmu_NMU]
set_property HDL_ATTRIBUTE.NOC.IS_NOC_NET true [get_bd_nets S03_AXI_nmu_NMU]
set_property HDL_ATTRIBUTE.SYNTH_ONLY true [get_bd_nets S03_AXI_nmu_NMU]
set_property HDL_ATTRIBUTE.EXT_CONN TRUE [get_bd_nets m00_axi_nsu_if_noc_npp_in_noc_credit_rdy]
set_property HDL_ATTRIBUTE.HIDDEN TRUE [get_bd_nets m00_axi_nsu_if_noc_npp_in_noc_credit_rdy]
set_property HDL_ATTRIBUTE.SIM_ONLY TRUE [get_bd_nets m00_axi_nsu_if_noc_npp_in_noc_credit_rdy]
set_property HDL_ATTRIBUTE.EXT_CONN TRUE [get_bd_nets m00_axi_nsu_if_noc_npp_in_noc_credit_return]
set_property HDL_ATTRIBUTE.HIDDEN TRUE [get_bd_nets m00_axi_nsu_if_noc_npp_in_noc_credit_return]
set_property HDL_ATTRIBUTE.SIM_ONLY TRUE [get_bd_nets m00_axi_nsu_if_noc_npp_in_noc_credit_return]
set_property HDL_ATTRIBUTE.EXT_CONN TRUE [get_bd_nets m00_axi_nsu_if_noc_npp_in_noc_flit]
set_property HDL_ATTRIBUTE.HIDDEN TRUE [get_bd_nets m00_axi_nsu_if_noc_npp_in_noc_flit]
set_property HDL_ATTRIBUTE.SIM_ONLY TRUE [get_bd_nets m00_axi_nsu_if_noc_npp_in_noc_flit]
set_property HDL_ATTRIBUTE.EXT_CONN TRUE [get_bd_nets m00_axi_nsu_if_noc_npp_in_noc_valid]
set_property HDL_ATTRIBUTE.HIDDEN TRUE [get_bd_nets m00_axi_nsu_if_noc_npp_in_noc_valid]
set_property HDL_ATTRIBUTE.SIM_ONLY TRUE [get_bd_nets m00_axi_nsu_if_noc_npp_in_noc_valid]
set_property HDL_ATTRIBUTE.EXT_CONN TRUE [get_bd_nets m00_axi_nsu_if_noc_npp_out_noc_credit_rdy]
set_property HDL_ATTRIBUTE.HIDDEN TRUE [get_bd_nets m00_axi_nsu_if_noc_npp_out_noc_credit_rdy]
set_property HDL_ATTRIBUTE.SIM_ONLY TRUE [get_bd_nets m00_axi_nsu_if_noc_npp_out_noc_credit_rdy]
set_property HDL_ATTRIBUTE.EXT_CONN TRUE [get_bd_nets m00_axi_nsu_if_noc_npp_out_noc_credit_return]
set_property HDL_ATTRIBUTE.HIDDEN TRUE [get_bd_nets m00_axi_nsu_if_noc_npp_out_noc_credit_return]
set_property HDL_ATTRIBUTE.SIM_ONLY TRUE [get_bd_nets m00_axi_nsu_if_noc_npp_out_noc_credit_return]
set_property HDL_ATTRIBUTE.EXT_CONN TRUE [get_bd_nets m00_axi_nsu_if_noc_npp_out_noc_flit]
set_property HDL_ATTRIBUTE.HIDDEN TRUE [get_bd_nets m00_axi_nsu_if_noc_npp_out_noc_flit]
set_property HDL_ATTRIBUTE.SIM_ONLY TRUE [get_bd_nets m00_axi_nsu_if_noc_npp_out_noc_flit]
set_property HDL_ATTRIBUTE.EXT_CONN TRUE [get_bd_nets m00_axi_nsu_if_noc_npp_out_noc_valid]
set_property HDL_ATTRIBUTE.HIDDEN TRUE [get_bd_nets m00_axi_nsu_if_noc_npp_out_noc_valid]
set_property HDL_ATTRIBUTE.SIM_ONLY TRUE [get_bd_nets m00_axi_nsu_if_noc_npp_out_noc_valid]
set_property HDL_ATTRIBUTE.EXT_CONN TRUE [get_bd_nets m01_axi_nsu_if_noc_npp_in_noc_credit_rdy]
set_property HDL_ATTRIBUTE.HIDDEN TRUE [get_bd_nets m01_axi_nsu_if_noc_npp_in_noc_credit_rdy]
set_property HDL_ATTRIBUTE.SIM_ONLY TRUE [get_bd_nets m01_axi_nsu_if_noc_npp_in_noc_credit_rdy]
set_property HDL_ATTRIBUTE.EXT_CONN TRUE [get_bd_nets m01_axi_nsu_if_noc_npp_in_noc_credit_return]
set_property HDL_ATTRIBUTE.HIDDEN TRUE [get_bd_nets m01_axi_nsu_if_noc_npp_in_noc_credit_return]
set_property HDL_ATTRIBUTE.SIM_ONLY TRUE [get_bd_nets m01_axi_nsu_if_noc_npp_in_noc_credit_return]
set_property HDL_ATTRIBUTE.EXT_CONN TRUE [get_bd_nets m01_axi_nsu_if_noc_npp_in_noc_flit]
set_property HDL_ATTRIBUTE.HIDDEN TRUE [get_bd_nets m01_axi_nsu_if_noc_npp_in_noc_flit]
set_property HDL_ATTRIBUTE.SIM_ONLY TRUE [get_bd_nets m01_axi_nsu_if_noc_npp_in_noc_flit]
set_property HDL_ATTRIBUTE.EXT_CONN TRUE [get_bd_nets m01_axi_nsu_if_noc_npp_in_noc_valid]
set_property HDL_ATTRIBUTE.HIDDEN TRUE [get_bd_nets m01_axi_nsu_if_noc_npp_in_noc_valid]
set_property HDL_ATTRIBUTE.SIM_ONLY TRUE [get_bd_nets m01_axi_nsu_if_noc_npp_in_noc_valid]
set_property HDL_ATTRIBUTE.EXT_CONN TRUE [get_bd_nets m01_axi_nsu_if_noc_npp_out_noc_credit_rdy]
set_property HDL_ATTRIBUTE.HIDDEN TRUE [get_bd_nets m01_axi_nsu_if_noc_npp_out_noc_credit_rdy]
set_property HDL_ATTRIBUTE.SIM_ONLY TRUE [get_bd_nets m01_axi_nsu_if_noc_npp_out_noc_credit_rdy]
set_property HDL_ATTRIBUTE.EXT_CONN TRUE [get_bd_nets m01_axi_nsu_if_noc_npp_out_noc_credit_return]
set_property HDL_ATTRIBUTE.HIDDEN TRUE [get_bd_nets m01_axi_nsu_if_noc_npp_out_noc_credit_return]
set_property HDL_ATTRIBUTE.SIM_ONLY TRUE [get_bd_nets m01_axi_nsu_if_noc_npp_out_noc_credit_return]
set_property HDL_ATTRIBUTE.EXT_CONN TRUE [get_bd_nets m01_axi_nsu_if_noc_npp_out_noc_flit]
set_property HDL_ATTRIBUTE.HIDDEN TRUE [get_bd_nets m01_axi_nsu_if_noc_npp_out_noc_flit]
set_property HDL_ATTRIBUTE.SIM_ONLY TRUE [get_bd_nets m01_axi_nsu_if_noc_npp_out_noc_flit]
set_property HDL_ATTRIBUTE.EXT_CONN TRUE [get_bd_nets m01_axi_nsu_if_noc_npp_out_noc_valid]
set_property HDL_ATTRIBUTE.HIDDEN TRUE [get_bd_nets m01_axi_nsu_if_noc_npp_out_noc_valid]
set_property HDL_ATTRIBUTE.SIM_ONLY TRUE [get_bd_nets m01_axi_nsu_if_noc_npp_out_noc_valid]
set_property HDL_ATTRIBUTE.EXT_CONN TRUE [get_bd_nets m02_axi_nsu_if_noc_npp_in_noc_credit_rdy]
set_property HDL_ATTRIBUTE.HIDDEN TRUE [get_bd_nets m02_axi_nsu_if_noc_npp_in_noc_credit_rdy]
set_property HDL_ATTRIBUTE.SIM_ONLY TRUE [get_bd_nets m02_axi_nsu_if_noc_npp_in_noc_credit_rdy]
set_property HDL_ATTRIBUTE.EXT_CONN TRUE [get_bd_nets m02_axi_nsu_if_noc_npp_in_noc_credit_return]
set_property HDL_ATTRIBUTE.HIDDEN TRUE [get_bd_nets m02_axi_nsu_if_noc_npp_in_noc_credit_return]
set_property HDL_ATTRIBUTE.SIM_ONLY TRUE [get_bd_nets m02_axi_nsu_if_noc_npp_in_noc_credit_return]
set_property HDL_ATTRIBUTE.EXT_CONN TRUE [get_bd_nets m02_axi_nsu_if_noc_npp_in_noc_flit]
set_property HDL_ATTRIBUTE.HIDDEN TRUE [get_bd_nets m02_axi_nsu_if_noc_npp_in_noc_flit]
set_property HDL_ATTRIBUTE.SIM_ONLY TRUE [get_bd_nets m02_axi_nsu_if_noc_npp_in_noc_flit]
set_property HDL_ATTRIBUTE.EXT_CONN TRUE [get_bd_nets m02_axi_nsu_if_noc_npp_in_noc_valid]
set_property HDL_ATTRIBUTE.HIDDEN TRUE [get_bd_nets m02_axi_nsu_if_noc_npp_in_noc_valid]
set_property HDL_ATTRIBUTE.SIM_ONLY TRUE [get_bd_nets m02_axi_nsu_if_noc_npp_in_noc_valid]
set_property HDL_ATTRIBUTE.EXT_CONN TRUE [get_bd_nets m02_axi_nsu_if_noc_npp_out_noc_credit_rdy]
set_property HDL_ATTRIBUTE.HIDDEN TRUE [get_bd_nets m02_axi_nsu_if_noc_npp_out_noc_credit_rdy]
set_property HDL_ATTRIBUTE.SIM_ONLY TRUE [get_bd_nets m02_axi_nsu_if_noc_npp_out_noc_credit_rdy]
set_property HDL_ATTRIBUTE.EXT_CONN TRUE [get_bd_nets m02_axi_nsu_if_noc_npp_out_noc_credit_return]
set_property HDL_ATTRIBUTE.HIDDEN TRUE [get_bd_nets m02_axi_nsu_if_noc_npp_out_noc_credit_return]
set_property HDL_ATTRIBUTE.SIM_ONLY TRUE [get_bd_nets m02_axi_nsu_if_noc_npp_out_noc_credit_return]
set_property HDL_ATTRIBUTE.EXT_CONN TRUE [get_bd_nets m02_axi_nsu_if_noc_npp_out_noc_flit]
set_property HDL_ATTRIBUTE.HIDDEN TRUE [get_bd_nets m02_axi_nsu_if_noc_npp_out_noc_flit]
set_property HDL_ATTRIBUTE.SIM_ONLY TRUE [get_bd_nets m02_axi_nsu_if_noc_npp_out_noc_flit]
set_property HDL_ATTRIBUTE.EXT_CONN TRUE [get_bd_nets m02_axi_nsu_if_noc_npp_out_noc_valid]
set_property HDL_ATTRIBUTE.HIDDEN TRUE [get_bd_nets m02_axi_nsu_if_noc_npp_out_noc_valid]
set_property HDL_ATTRIBUTE.SIM_ONLY TRUE [get_bd_nets m02_axi_nsu_if_noc_npp_out_noc_valid]
set_property HDL_ATTRIBUTE.EXT_CONN TRUE [get_bd_nets m03_axi_nsu_if_noc_npp_in_noc_credit_rdy]
set_property HDL_ATTRIBUTE.HIDDEN TRUE [get_bd_nets m03_axi_nsu_if_noc_npp_in_noc_credit_rdy]
set_property HDL_ATTRIBUTE.SIM_ONLY TRUE [get_bd_nets m03_axi_nsu_if_noc_npp_in_noc_credit_rdy]
set_property HDL_ATTRIBUTE.EXT_CONN TRUE [get_bd_nets m03_axi_nsu_if_noc_npp_in_noc_credit_return]
set_property HDL_ATTRIBUTE.HIDDEN TRUE [get_bd_nets m03_axi_nsu_if_noc_npp_in_noc_credit_return]
set_property HDL_ATTRIBUTE.SIM_ONLY TRUE [get_bd_nets m03_axi_nsu_if_noc_npp_in_noc_credit_return]
set_property HDL_ATTRIBUTE.EXT_CONN TRUE [get_bd_nets m03_axi_nsu_if_noc_npp_in_noc_flit]
set_property HDL_ATTRIBUTE.HIDDEN TRUE [get_bd_nets m03_axi_nsu_if_noc_npp_in_noc_flit]
set_property HDL_ATTRIBUTE.SIM_ONLY TRUE [get_bd_nets m03_axi_nsu_if_noc_npp_in_noc_flit]
set_property HDL_ATTRIBUTE.EXT_CONN TRUE [get_bd_nets m03_axi_nsu_if_noc_npp_in_noc_valid]
set_property HDL_ATTRIBUTE.HIDDEN TRUE [get_bd_nets m03_axi_nsu_if_noc_npp_in_noc_valid]
set_property HDL_ATTRIBUTE.SIM_ONLY TRUE [get_bd_nets m03_axi_nsu_if_noc_npp_in_noc_valid]
set_property HDL_ATTRIBUTE.EXT_CONN TRUE [get_bd_nets m03_axi_nsu_if_noc_npp_out_noc_credit_rdy]
set_property HDL_ATTRIBUTE.HIDDEN TRUE [get_bd_nets m03_axi_nsu_if_noc_npp_out_noc_credit_rdy]
set_property HDL_ATTRIBUTE.SIM_ONLY TRUE [get_bd_nets m03_axi_nsu_if_noc_npp_out_noc_credit_rdy]
set_property HDL_ATTRIBUTE.EXT_CONN TRUE [get_bd_nets m03_axi_nsu_if_noc_npp_out_noc_credit_return]
set_property HDL_ATTRIBUTE.HIDDEN TRUE [get_bd_nets m03_axi_nsu_if_noc_npp_out_noc_credit_return]
set_property HDL_ATTRIBUTE.SIM_ONLY TRUE [get_bd_nets m03_axi_nsu_if_noc_npp_out_noc_credit_return]
set_property HDL_ATTRIBUTE.EXT_CONN TRUE [get_bd_nets m03_axi_nsu_if_noc_npp_out_noc_flit]
set_property HDL_ATTRIBUTE.HIDDEN TRUE [get_bd_nets m03_axi_nsu_if_noc_npp_out_noc_flit]
set_property HDL_ATTRIBUTE.SIM_ONLY TRUE [get_bd_nets m03_axi_nsu_if_noc_npp_out_noc_flit]
set_property HDL_ATTRIBUTE.EXT_CONN TRUE [get_bd_nets m03_axi_nsu_if_noc_npp_out_noc_valid]
set_property HDL_ATTRIBUTE.HIDDEN TRUE [get_bd_nets m03_axi_nsu_if_noc_npp_out_noc_valid]
set_property HDL_ATTRIBUTE.SIM_ONLY TRUE [get_bd_nets m03_axi_nsu_if_noc_npp_out_noc_valid]
set_property HDL_ATTRIBUTE.EXT_CONN TRUE [get_bd_nets mc0_ddrc_dmc2noc_credit_rdy_0]
set_property HDL_ATTRIBUTE.HIDDEN TRUE [get_bd_nets mc0_ddrc_dmc2noc_credit_rdy_0]
set_property HDL_ATTRIBUTE.SIM_ONLY TRUE [get_bd_nets mc0_ddrc_dmc2noc_credit_rdy_0]
set_property HDL_ATTRIBUTE.EXT_CONN TRUE [get_bd_nets mc0_ddrc_dmc2noc_credit_rdy_1]
set_property HDL_ATTRIBUTE.HIDDEN TRUE [get_bd_nets mc0_ddrc_dmc2noc_credit_rdy_1]
set_property HDL_ATTRIBUTE.SIM_ONLY TRUE [get_bd_nets mc0_ddrc_dmc2noc_credit_rdy_1]
set_property HDL_ATTRIBUTE.EXT_CONN TRUE [get_bd_nets mc0_ddrc_dmc2noc_credit_rdy_2]
set_property HDL_ATTRIBUTE.HIDDEN TRUE [get_bd_nets mc0_ddrc_dmc2noc_credit_rdy_2]
set_property HDL_ATTRIBUTE.SIM_ONLY TRUE [get_bd_nets mc0_ddrc_dmc2noc_credit_rdy_2]
set_property HDL_ATTRIBUTE.EXT_CONN TRUE [get_bd_nets mc0_ddrc_dmc2noc_credit_rdy_3]
set_property HDL_ATTRIBUTE.HIDDEN TRUE [get_bd_nets mc0_ddrc_dmc2noc_credit_rdy_3]
set_property HDL_ATTRIBUTE.SIM_ONLY TRUE [get_bd_nets mc0_ddrc_dmc2noc_credit_rdy_3]
set_property HDL_ATTRIBUTE.EXT_CONN TRUE [get_bd_nets mc0_ddrc_dmc2noc_credit_rtn_0]
set_property HDL_ATTRIBUTE.HIDDEN TRUE [get_bd_nets mc0_ddrc_dmc2noc_credit_rtn_0]
set_property HDL_ATTRIBUTE.SIM_ONLY TRUE [get_bd_nets mc0_ddrc_dmc2noc_credit_rtn_0]
set_property HDL_ATTRIBUTE.EXT_CONN TRUE [get_bd_nets mc0_ddrc_dmc2noc_credit_rtn_1]
set_property HDL_ATTRIBUTE.HIDDEN TRUE [get_bd_nets mc0_ddrc_dmc2noc_credit_rtn_1]
set_property HDL_ATTRIBUTE.SIM_ONLY TRUE [get_bd_nets mc0_ddrc_dmc2noc_credit_rtn_1]
set_property HDL_ATTRIBUTE.EXT_CONN TRUE [get_bd_nets mc0_ddrc_dmc2noc_credit_rtn_2]
set_property HDL_ATTRIBUTE.HIDDEN TRUE [get_bd_nets mc0_ddrc_dmc2noc_credit_rtn_2]
set_property HDL_ATTRIBUTE.SIM_ONLY TRUE [get_bd_nets mc0_ddrc_dmc2noc_credit_rtn_2]
set_property HDL_ATTRIBUTE.EXT_CONN TRUE [get_bd_nets mc0_ddrc_dmc2noc_credit_rtn_3]
set_property HDL_ATTRIBUTE.HIDDEN TRUE [get_bd_nets mc0_ddrc_dmc2noc_credit_rtn_3]
set_property HDL_ATTRIBUTE.SIM_ONLY TRUE [get_bd_nets mc0_ddrc_dmc2noc_credit_rtn_3]
set_property HDL_ATTRIBUTE.EXT_CONN TRUE [get_bd_nets mc0_ddrc_dmc2noc_data_out_0]
set_property HDL_ATTRIBUTE.HIDDEN TRUE [get_bd_nets mc0_ddrc_dmc2noc_data_out_0]
set_property HDL_ATTRIBUTE.SIM_ONLY TRUE [get_bd_nets mc0_ddrc_dmc2noc_data_out_0]
set_property HDL_ATTRIBUTE.EXT_CONN TRUE [get_bd_nets mc0_ddrc_dmc2noc_data_out_1]
set_property HDL_ATTRIBUTE.HIDDEN TRUE [get_bd_nets mc0_ddrc_dmc2noc_data_out_1]
set_property HDL_ATTRIBUTE.SIM_ONLY TRUE [get_bd_nets mc0_ddrc_dmc2noc_data_out_1]
set_property HDL_ATTRIBUTE.EXT_CONN TRUE [get_bd_nets mc0_ddrc_dmc2noc_data_out_2]
set_property HDL_ATTRIBUTE.HIDDEN TRUE [get_bd_nets mc0_ddrc_dmc2noc_data_out_2]
set_property HDL_ATTRIBUTE.SIM_ONLY TRUE [get_bd_nets mc0_ddrc_dmc2noc_data_out_2]
set_property HDL_ATTRIBUTE.EXT_CONN TRUE [get_bd_nets mc0_ddrc_dmc2noc_data_out_3]
set_property HDL_ATTRIBUTE.HIDDEN TRUE [get_bd_nets mc0_ddrc_dmc2noc_data_out_3]
set_property HDL_ATTRIBUTE.SIM_ONLY TRUE [get_bd_nets mc0_ddrc_dmc2noc_data_out_3]
set_property HDL_ATTRIBUTE.EXT_CONN TRUE [get_bd_nets mc0_ddrc_dmc2noc_valid_out_0]
set_property HDL_ATTRIBUTE.HIDDEN TRUE [get_bd_nets mc0_ddrc_dmc2noc_valid_out_0]
set_property HDL_ATTRIBUTE.SIM_ONLY TRUE [get_bd_nets mc0_ddrc_dmc2noc_valid_out_0]
set_property HDL_ATTRIBUTE.EXT_CONN TRUE [get_bd_nets mc0_ddrc_dmc2noc_valid_out_1]
set_property HDL_ATTRIBUTE.HIDDEN TRUE [get_bd_nets mc0_ddrc_dmc2noc_valid_out_1]
set_property HDL_ATTRIBUTE.SIM_ONLY TRUE [get_bd_nets mc0_ddrc_dmc2noc_valid_out_1]
set_property HDL_ATTRIBUTE.EXT_CONN TRUE [get_bd_nets mc0_ddrc_dmc2noc_valid_out_2]
set_property HDL_ATTRIBUTE.HIDDEN TRUE [get_bd_nets mc0_ddrc_dmc2noc_valid_out_2]
set_property HDL_ATTRIBUTE.SIM_ONLY TRUE [get_bd_nets mc0_ddrc_dmc2noc_valid_out_2]
set_property HDL_ATTRIBUTE.EXT_CONN TRUE [get_bd_nets mc0_ddrc_dmc2noc_valid_out_3]
set_property HDL_ATTRIBUTE.HIDDEN TRUE [get_bd_nets mc0_ddrc_dmc2noc_valid_out_3]
set_property HDL_ATTRIBUTE.SIM_ONLY TRUE [get_bd_nets mc0_ddrc_dmc2noc_valid_out_3]
set_property HDL_ATTRIBUTE.EXT_CONN TRUE [get_bd_nets mc0_ddrc_noc2dmc_credit_rdy_0]
set_property HDL_ATTRIBUTE.HIDDEN TRUE [get_bd_nets mc0_ddrc_noc2dmc_credit_rdy_0]
set_property HDL_ATTRIBUTE.SIM_ONLY TRUE [get_bd_nets mc0_ddrc_noc2dmc_credit_rdy_0]
set_property HDL_ATTRIBUTE.EXT_CONN TRUE [get_bd_nets mc0_ddrc_noc2dmc_credit_rdy_1]
set_property HDL_ATTRIBUTE.HIDDEN TRUE [get_bd_nets mc0_ddrc_noc2dmc_credit_rdy_1]
set_property HDL_ATTRIBUTE.SIM_ONLY TRUE [get_bd_nets mc0_ddrc_noc2dmc_credit_rdy_1]
set_property HDL_ATTRIBUTE.EXT_CONN TRUE [get_bd_nets mc0_ddrc_noc2dmc_credit_rdy_2]
set_property HDL_ATTRIBUTE.HIDDEN TRUE [get_bd_nets mc0_ddrc_noc2dmc_credit_rdy_2]
set_property HDL_ATTRIBUTE.SIM_ONLY TRUE [get_bd_nets mc0_ddrc_noc2dmc_credit_rdy_2]
set_property HDL_ATTRIBUTE.EXT_CONN TRUE [get_bd_nets mc0_ddrc_noc2dmc_credit_rdy_3]
set_property HDL_ATTRIBUTE.HIDDEN TRUE [get_bd_nets mc0_ddrc_noc2dmc_credit_rdy_3]
set_property HDL_ATTRIBUTE.SIM_ONLY TRUE [get_bd_nets mc0_ddrc_noc2dmc_credit_rdy_3]
set_property HDL_ATTRIBUTE.EXT_CONN TRUE [get_bd_nets mc0_ddrc_noc2dmc_credit_rtn_0]
set_property HDL_ATTRIBUTE.HIDDEN TRUE [get_bd_nets mc0_ddrc_noc2dmc_credit_rtn_0]
set_property HDL_ATTRIBUTE.SIM_ONLY TRUE [get_bd_nets mc0_ddrc_noc2dmc_credit_rtn_0]
set_property HDL_ATTRIBUTE.EXT_CONN TRUE [get_bd_nets mc0_ddrc_noc2dmc_credit_rtn_1]
set_property HDL_ATTRIBUTE.HIDDEN TRUE [get_bd_nets mc0_ddrc_noc2dmc_credit_rtn_1]
set_property HDL_ATTRIBUTE.SIM_ONLY TRUE [get_bd_nets mc0_ddrc_noc2dmc_credit_rtn_1]
set_property HDL_ATTRIBUTE.EXT_CONN TRUE [get_bd_nets mc0_ddrc_noc2dmc_credit_rtn_2]
set_property HDL_ATTRIBUTE.HIDDEN TRUE [get_bd_nets mc0_ddrc_noc2dmc_credit_rtn_2]
set_property HDL_ATTRIBUTE.SIM_ONLY TRUE [get_bd_nets mc0_ddrc_noc2dmc_credit_rtn_2]
set_property HDL_ATTRIBUTE.EXT_CONN TRUE [get_bd_nets mc0_ddrc_noc2dmc_credit_rtn_3]
set_property HDL_ATTRIBUTE.HIDDEN TRUE [get_bd_nets mc0_ddrc_noc2dmc_credit_rtn_3]
set_property HDL_ATTRIBUTE.SIM_ONLY TRUE [get_bd_nets mc0_ddrc_noc2dmc_credit_rtn_3]
set_property HDL_ATTRIBUTE.EXT_CONN TRUE [get_bd_nets mc0_ddrc_noc2dmc_data_in_0]
set_property HDL_ATTRIBUTE.HIDDEN TRUE [get_bd_nets mc0_ddrc_noc2dmc_data_in_0]
set_property HDL_ATTRIBUTE.SIM_ONLY TRUE [get_bd_nets mc0_ddrc_noc2dmc_data_in_0]
set_property HDL_ATTRIBUTE.EXT_CONN TRUE [get_bd_nets mc0_ddrc_noc2dmc_data_in_1]
set_property HDL_ATTRIBUTE.HIDDEN TRUE [get_bd_nets mc0_ddrc_noc2dmc_data_in_1]
set_property HDL_ATTRIBUTE.SIM_ONLY TRUE [get_bd_nets mc0_ddrc_noc2dmc_data_in_1]
set_property HDL_ATTRIBUTE.EXT_CONN TRUE [get_bd_nets mc0_ddrc_noc2dmc_data_in_2]
set_property HDL_ATTRIBUTE.HIDDEN TRUE [get_bd_nets mc0_ddrc_noc2dmc_data_in_2]
